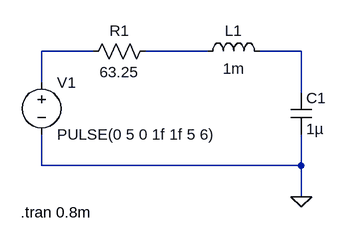
[diagram p0: schematic Draft1.asc]
Draft1.asc, the LTspice schematic file:
Version 4.1
SHEET 1 880 680
WIRE -16 80 -96 80
WIRE 160 80 64 80
WIRE 304 80 240 80
WIRE -96 128 -96 80
WIRE 304 144 304 80
WIRE -96 256 -96 208
WIRE 304 256 304 208
WIRE 304 256 -96 256
WIRE 304 304 304 256
FLAG 304 304 0
SYMBOL res 80 64 R90
WINDOW 0 0 56 VBottom 2
WINDOW 3 32 56 VTop 2
SYMATTR InstName R1
SYMATTR Value 63.25
SYMBOL ind 144 96 R270
WINDOW 0 32 56 VTop 2
WINDOW 3 5 56 VBottom 2
SYMATTR InstName L1
SYMATTR Value 1m
SYMBOL cap 288 144 R0
SYMATTR InstName C1
SYMATTR Value 1µ
SYMBOL voltage -96 112 R0
WINDOW 123 0 0 Left 0
WINDOW 39 0 0 Left 0
SYMATTR InstName V1
SYMATTR Value PULSE(0 5 0 1f 1f 5 6)
TEXT -128 328 Left 2 !.tran 0.8m

The netlist it stands for:
* Draft1.asc
R1 N002 N001 63.25
L1 N002 N003 1m
C1 N003 0 1µ
V1 N001 0 PULSE(0 5 0 1f 1f 5 6)
.tran 0.8m
.backanno
.end